# Altium schematic sheet POWER DIAGRAM.SchDoc
size A3; SheetNumber: 1; SheetTotal: 5
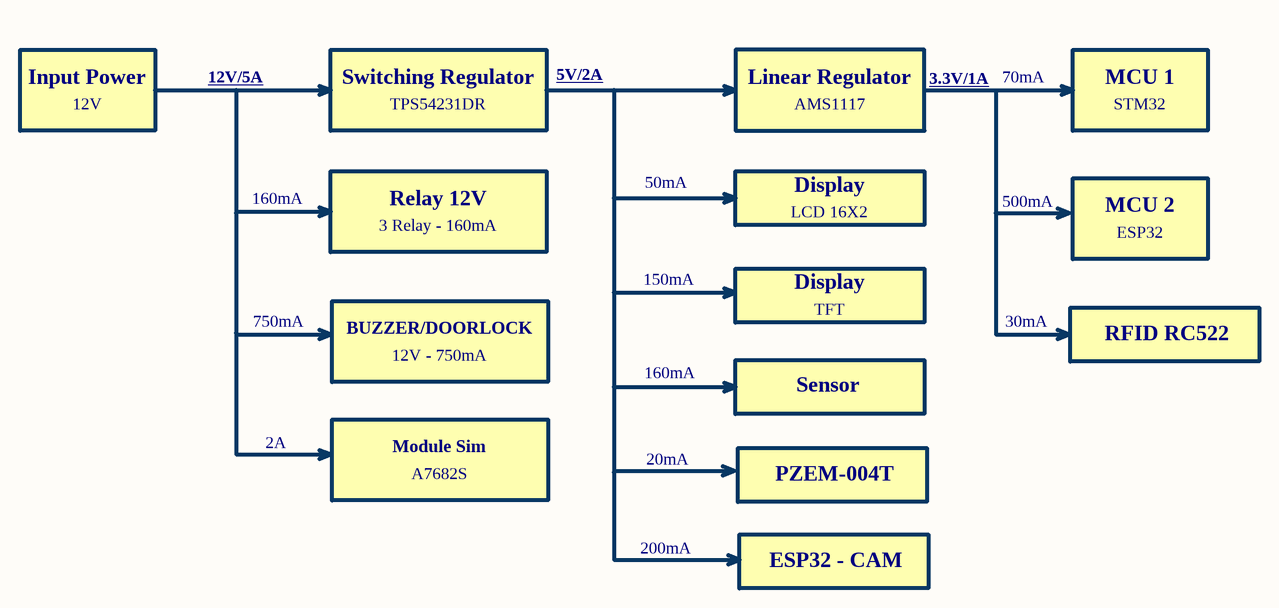
[diagram p0: POWER DIAGRAM.SchDoc]

## Notes on the sheet
- Input Power
- 12V/5A
- Switching Regulator
- 5V/2A
- Linear Regulator
- 3.3V/1A
- 70mA
- MCU 1
- 12V
- TPS54231DR
- AMS1117
- STM32
- 160mA
- Relay 12V
- 3 Relay - 160mA
- 50mA
- Display
- LCD 16X2
- 500mA
- MCU 2
- ESP32
- 150mA
- 750mA
- BUZZER/DOORLOCK
- 12V - 750mA
- TFT
- 30mA
- RFID RC522
- Sensor
- 2A
- Module Sim
- A7682S
- 20mA
- PZEM-004T
- 200mA
- ESP32 - CAM